# Altium schematic sheet GTU-2-V1.1-20160516.SCHDOC
size A3
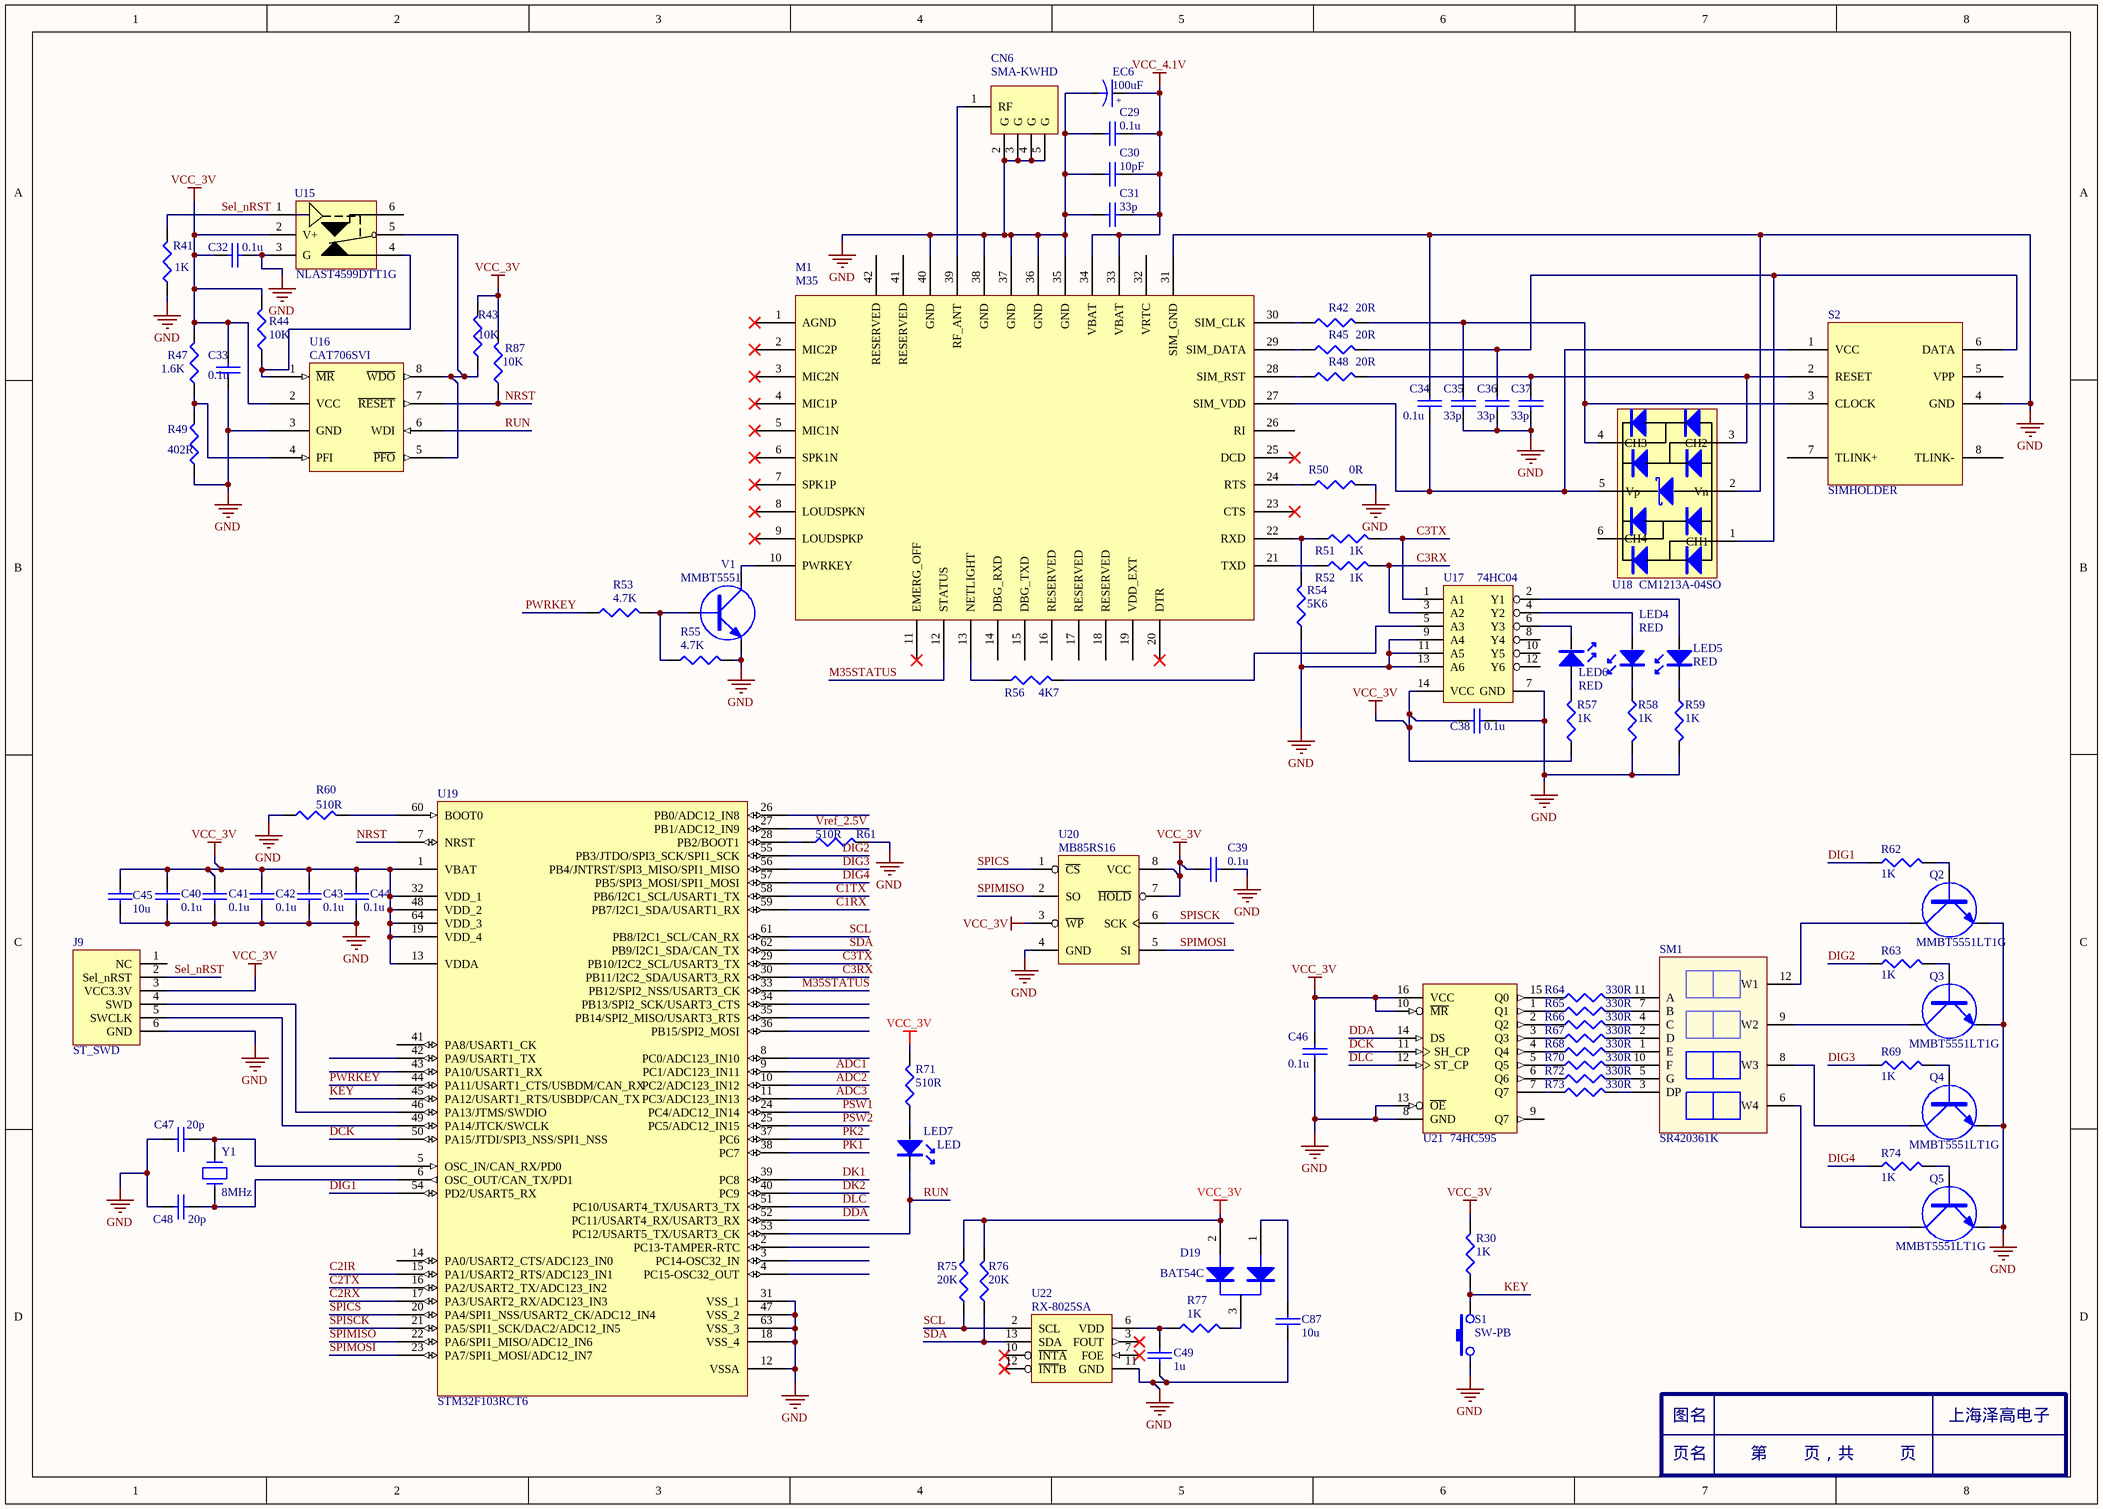
[diagram p0: GTU-2-V1.1-20160516.SCHDOC]

## Parts
4  Component_1  (value not drawn)
C29  0.1u  [0805-C]
C30  10pF  [0805-C]
C31  33p  [0805-C]
C32  0.1u  [0805-C]
C33  0.1u  [0805-C]
C34  0.1u  [0805-C]
C35  33p  [0805-C]
C36  33p  [0805-C]
C37  33p  [0805-C]
C38  0.1u  [0805-C]
C39  0.1u  [0805-C]
C40  0.1u  [0805-C]
C41  0.1u  [0805-C]
C42  0.1u  [0805-C]
C43  0.1u  [0805-C]
C44  0.1u  [0805-C]
C45  10u  [0805-C]
C46  0.1u  [0805-C]
C47  20p  [0805-C]
C48  20p  [0805-C]
C49  1u  [0805-C]
C87  10u  [0805-C]
CN6  SMA-KWHD  [SMA-KWHD]
D19  BAT54C  [BAT54S/SOT-23]
EC6  100uF  [7361-V]
J9  ST_SWD  [SWD_DOWNLOAD]
LED4  RED  [0805-LED]
LED5  RED  [0805-LED]
LED6  RED  [0805-LED]
LED7  LED  [0805-LED]
M1  M35  [M35]
Q2  MFG2-PN: MMBT5551LT1G  [SOT-23]  (hidden comment: MMBT5551)
Q3  MFG2-PN: MMBT5551LT1G  [SOT-23]  (hidden comment: MMBT5551)
Q4  MFG2-PN: MMBT5551LT1G  [SOT-23]  (hidden comment: MMBT5551)
Q5  MFG2-PN: MMBT5551LT1G  [SOT-23]  (hidden comment: MMBT5551)
R30  1K  [0805-R]
R41  value 1K  [0805-R]  (hidden comment: RES)
R42  20R  [0805-R]
R43  10K  [0805-R]
R44  10K  [0805-R]
R45  20R  [0805-R]
R47  1.6K  [0805-R]
R48  20R  [0805-R]
R49  402R  [0805-R]
R50  0R  [0805-R]
R51  1K  [0805-R]
R52  1K  [0805-R]
R53  4.7K  [0805-R]
R54  5K6  [0805-R]
R55  4.7K  [0805-R]
R56  4K7  [0805-R]
R57  1K  [0805-R]
R58  1K  [0805-R]
R59  1K  [0805-R]
R60  510R  [0805-R]
R61  510R  [0805-R]
R62  value 1K  [0805-R]  (hidden comment: RES)
R63  value 1K  [0805-R]  (hidden comment: RES)
R64  330R  [0805-R]
R65  330R  [0805-R]
R66  330R  [0805-R]
R67  330R  [0805-R]
R68  330R  [0805-R]
R69  value 1K  [0805-R]  (hidden comment: RES)
R70  330R  [0805-R]
R71  510R  [0805-R]
R72  330R  [0805-R]
R73  330R  [0805-R]
R74  value 1K  [0805-R]  (hidden comment: RES)
R75  20K  [0805-R]
R76  20K  [0805-R]
R77  1K  [0805-R]
R87  10K  [0805-R]
S1  SW-PB  [JMP]
S2  SIMHOLDER  [SIM-HOLDER]
SM1  SR420361K  [SR420361]
U15  NLAST4599DTT1G  [SOT-23-6]
U16  CAT706SVI  [SO-8]
U17  74HC04  [SO-14]
U18  CM1213A-04SO  [SOT-23-6]
U19  STM32F103RCT6  [LQFP-64]
U20  MB85RS16  [SO-8]
U21  74HC595  [SO-16]
U22  RX-8025SA  [SO-14]
V1  MMBT5551  [SOT-23]
Y1  8MHz  [SM-49]

## Nets
GND: C29.2 C30.2 C31.2 C32.2 C33.2 C34.1 C35.2 C36.2 C37.2 C38.2 C39.2 C40.2 C41.2 C42.2 C43.2 C44.2 C45.2 C46.2 C47.2 C48.2 C49.2 C87.2 CN6.2(G) CN6.3(G) CN6.4(G) CN6.5(G) EC6.2 J9.6(GND) M1.31(SIM_GND) M1.35(GND) M1.36(GND) M1.37(GND) M1.38(GND) M1.40(GND) Q2.2(E) Q3.2(E) Q4.2(E) Q5.2(E) R41.1 R49.1 R50.2 R54.1 R55.2 R58.2 R59.2 R60.1 R61.2 S1.1 S2.4(GND) U15.3(G) U16.3(GND) U17.7(GND) U17.9(A4) U17.11(A5) U17.13(A6) U18.2(Vn) U19.12(VSSA) U19.18(VSS_4) U19.31(VSS_1) U19.47(VSS_2) U19.63(VSS_3) U20.4(GND) U21.8(GND) U21.13(~{OE}) U22.11(GND) V1.2(E)
VCC_3V: C32.1 C33.1 C38.1 C39.1 C40.1 C41.1 C42.1 C43.1 C44.1 C45.1 C46.1 D19.2 J9.3(VCC3.3V) R30.2 R43.2 R44.2 R47.2 R57.1 R71.2 R75.2 R76.2 R87.2 U15.2(V+) U16.2(VCC) U17.14(VCC) U19.1(VBAT) U19.13(VDDA) U19.19(VDD_4) U19.32(VDD_1) U19.48(VDD_2) U19.64(VDD_3) U20.3(~{WP}) U20.7(~{HOLD}) U20.8(VCC) U21.10(~{MR}) U21.16(VCC)
VCC_4.1V: C29.1 C30.1 C31.1 EC6.1 M1.33(VBAT) M1.34(VBAT)
ADC1: U19.9(PC1/ADC123_IN11)
ADC2: U19.10(PC2/ADC123_IN12)
ADC3: U19.11(PC3/ADC123_IN13)
C1RX: U19.59(PB7/I2C1_SDA/USART1_RX)
C1TX: U19.58(PB6/I2C1_SCL/USART1_TX)
C2IR: U19.15(PA1/USART2_RTS/ADC123_IN1)
C2RX: U19.17(PA3/USART2_RX/ADC123_IN3)
C2TX: U19.16(PA2/USART2_TX/ADC123_IN2)
C3RX: R52.2 U17.3(A2) U19.30(PB11/I2C2_SDA/USART3_RX)
C3TX: R51.2 U17.1(A1) U19.29(PB10/I2C2_SCL/USART3_TX)
DCK: U19.50(PA15/JTDI/SPI3_NSS/SPI1_NSS) U21.11(SH_CP)
DDA: U19.52(PC11/USART4_RX/USART3_RX) U21.14(DS)
DIG1: R62.1 U19.54(PD2/USART5_RX)
DIG2: R63.1 U19.55(PB3/JTDO/SPI3_SCK/SPI1_SCK)
DIG3: R69.1 U19.56(PB4/JNTRST/SPI3_MISO/SPI1_MISO)
DIG4: R74.1 U19.57(PB5/SPI3_MOSI/SPI1_MOSI)
DK1: U19.39(PC8)
DK2: U19.40(PC9)
DLC: U19.51(PC10/USART4_TX/USART3_TX) U21.12(ST_CP)
KEY: R30.1 S1.2 U19.45(PA12/USART1_RTS/USBDP/CAN_TX)
M35STATUS: M1.12(STATUS) U19.33(PB12/SPI2_NSS/USART3_CK)
NRST: R87.1 U16.7(~{RESET}) U19.7(NRST)
PK1: U19.38(PC7)
PK2: U19.37(PC6)
PSW1: U19.24(PC4/ADC12_IN14)
PSW2: U19.25(PC5/ADC12_IN15)
PWRKEY: R53.1 U19.44(PA11/USART1_CTS/USBDM/CAN_RX)
RUN: LED7.2 U16.6(WDI) U19.53(PC12/USART5_TX/USART3_CK)
SCL: R75.1 U19.61(PB8/I2C1_SCL/CAN_RX) U22.2(SCL)
SDA: R76.1 U19.62(PB9/I2C1_SDA/CAN_TX) U22.13(SDA)
Sel_nRST: J9.2(Sel_nRST) R41.2 U15.1(SELECT)
SPICS: U19.20(PA4/SPI1_NSS/USART2_CK/ADC12_IN4) U20.1(~{CS})
SPIMISO: U19.22(PA6/SPI1_MISO/ADC12_IN6) U20.2(SO)
SPIMOSI: U19.23(PA7/SPI1_MOSI/ADC12_IN7) U20.5(SI)
SPISCK: U19.21(PA5/SPI1_SCK/DAC2/ADC12_IN5) U20.6(SCK)
Vref_2.5V: U19.27(PB1/ADC12_IN9)
NetC34_2: C34.2 M1.27(SIM_VDD) S2.1(VCC) U18.5(Vp)
NetC35_1: C35.1 R42.2 S2.3(CLOCK) U18.4(CH3)
NetC36_1: C36.1 R45.2 S2.6(DATA) U18.1(CH1)
NetC37_1: C37.1 R48.2 S2.2(RESET) U18.3(CH2)
NetC47_1: C47.1 U19.5(OSC_IN/CAN_RX/PD0) Y1.2
NetC48_1: C48.1 U19.6(OSC_OUT/CAN_TX/PD1) Y1.1
NetC49_1: C49.1 R77.1 U22.6(VDD)
NetC87_1: C87.1 D19.1
NetCN6_1: CN6.1(RF) M1.39(RF_ANT)
NetD19_3: D19.3 R77.2
NetJ9_4: J9.4(SWD) U19.46(PA13/JTMS/SWDIO)
NetJ9_5: J9.5(SWCLK) U19.49(PA14/JTCK/SWCLK)
NetLED4_1: LED4.1 U17.4(Y2)
NetLED4_2: LED4.2 R58.1
NetLED5_1: LED5.1 U17.2(Y1)
NetLED5_2: LED5.2 R59.1
NetLED6_1: LED6.1 R57.2
NetLED6_2: LED6.2 U17.6(Y3)
NetLED7_1: LED7.1 R71.1
NetM1_10: M1.10(PWRKEY) V1.3(C)
NetM1_13: M1.13(NETLIGHT) R56.1
NetM1_21: M1.21(TXD) R52.1
NetM1_22: M1.22(RXD) R51.1 R54.2
NetM1_24: M1.24(RTS) R50.1
NetM1_28: M1.28(SIM_RST) R48.1
NetM1_29: M1.29(SIM_DATA) R45.1
NetM1_30: M1.30(SIM_CLK) R42.1
NetQ2_1: Q2.1(B) R62.2
NetQ2_3: Q2.3(C) SM1.12(W1)
NetQ3_1: Q3.1(B) R63.2
NetQ3_3: Q3.3(C) SM1.9(W2)
NetQ4_1: Q4.1(B) R69.2
NetQ4_3: Q4.3(C) SM1.8(W3)
NetQ5_1: Q5.1(B) R74.2
NetQ5_3: Q5.3(C) SM1.6(W4)
NetR43_1: R43.1 U15.5(CON) U16.5(~{PFO}) U16.8(~{WDO})
NetR44_1: R44.1 U15.4(NC) U16.1(~{MR})
NetR47_1: R47.1 R49.2 U16.4(PFI)
NetR53_2: R53.2 R55.1 V1.1(B)
NetR56_2: R56.2 U17.5(A3)
NetR60_2: R60.2 U19.60(BOOT0)
NetR61_1: R61.1 U19.28(PB2/BOOT1)
NetR64_1: R64.1 U21.15(Q0)
NetR64_2: R64.2 SM1.11(A)
NetR65_1: R65.1 U21.1(Q1)
NetR65_2: R65.2 SM1.7(B)
NetR66_1: R66.1 U21.2(Q2)
NetR66_2: R66.2 SM1.4(C)
NetR67_1: R67.1 U21.3(Q3)
NetR67_2: R67.2 SM1.2(D)
NetR68_1: R68.1 U21.4(Q4)
NetR68_2: R68.2 SM1.1(E)
NetR70_1: R70.1 U21.5(Q5)
NetR70_2: R70.2 SM1.10(F)
NetR72_1: R72.1 U21.6(Q6)
NetR72_2: R72.2 SM1.5(G)
NetR73_1: R73.1 U21.7(Q7)
NetR73_2: R73.2 SM1.3(DP)

Not connected (* = marked no-connect by the designer): J9 1(NC); M1 1(AGND)* 2(MIC2P)* 3(MIC2N)* 4(MIC1P)* 5(MIC1N)* 6(SPK1N)* 7(SPK1P)* 8(LOUDSPKN)* 9(LOUDSPKP)* 11(EMERG_OFF)* 14(DBG_RXD) 15(DBG_TXD) 16(RESERVED) 17(RESERVED) 18(RESERVED) 19(VDD_EXT) 20(DTR)* 23(CTS)* 25(DCD)* 26(RI) 32(VRTC) 41(RESERVED) 42(RESERVED); S2 5(VPP) 7(TLINK+) 8(TLINK-); U15 6(NO); U17 8(Y4) 10(Y5) 12(Y6); U18 6(CH4); U19 2(PC13-TAMPER-RTC) 3(PC14-OSC32_IN) 4(PC15-OSC32_OUT) 8(PC0/ADC123_IN10) 14(PA0/USART2_CTS/ADC123_IN0) 26(PB0/ADC12_IN8) 34(PB13/SPI2_SCK/USART3_CTS) 35(PB14/SPI2_MISO/USART3_RTS) 36(PB15/SPI2_MOSI) 41(PA8/USART1_CK) 42(PA9/USART1_TX) 43(PA10/USART1_RX); U21 9(Q7); U22 3(FOUT)* 7(FOE)* 10(~{INTA})* 12(~{INT}B)*

## Notes on the sheet
- (in symbol CAP Tan) +
- (in symbol Component_1) 图名; 上海泽高电子; 页名; 第        页，共          页

## Library data of the parts
C29-C31 C33-C49 C87 = CAP: Capacitor
C32 = CAP: Capacitor; MFG: TDK; status: APPROVED; value: 0.1u
CN6 = SMA-KWHD: RF插座
EC6 = CAP Tan
J9 = ST_SWD: STM32 SWD调试端口
LED4-LED6 = LED
Q2-Q5 = MMBT5551: NPN Transistor 160V 0.6A; MFG: DIODES; MFG-PN: MMBT5551-7-F; datasheet: MMBT5551 160 v NPN型晶体管小信号; status: APPROVED; MFG2: ON Semiconductor
R30 R42-R45 R48 R50-R61 R64-R68 R70-R73 R75-R77 R87 = RES
R41 R62 R63 R69 R74 = RES: 电阻; MFG: YAGO; tatus: APPROVED; datasheet: YAGO国巨  贴片电阻手册2011版
R47 R49 = RES: 电阻; MFG: YAGO; tatus: APPROVED; value: 10K; datasheet: YAGO国巨  贴片电阻手册2011版
S1 = SW-PB: 轻触按钮
SM1 = SR420361: 共阴极0.28寸4位数码管品牌ARK
U16 = SP706T
U20 = FM25256B
U21 = 74HC595: 8位移位寄存器; MFG: NXP; MFG-PN: 74HC595D; Statue: APPROVED; datasheet: 74HC595   PDF
V1 = MMBT5551: 贴片NPN
Y1 = CRYSTAL